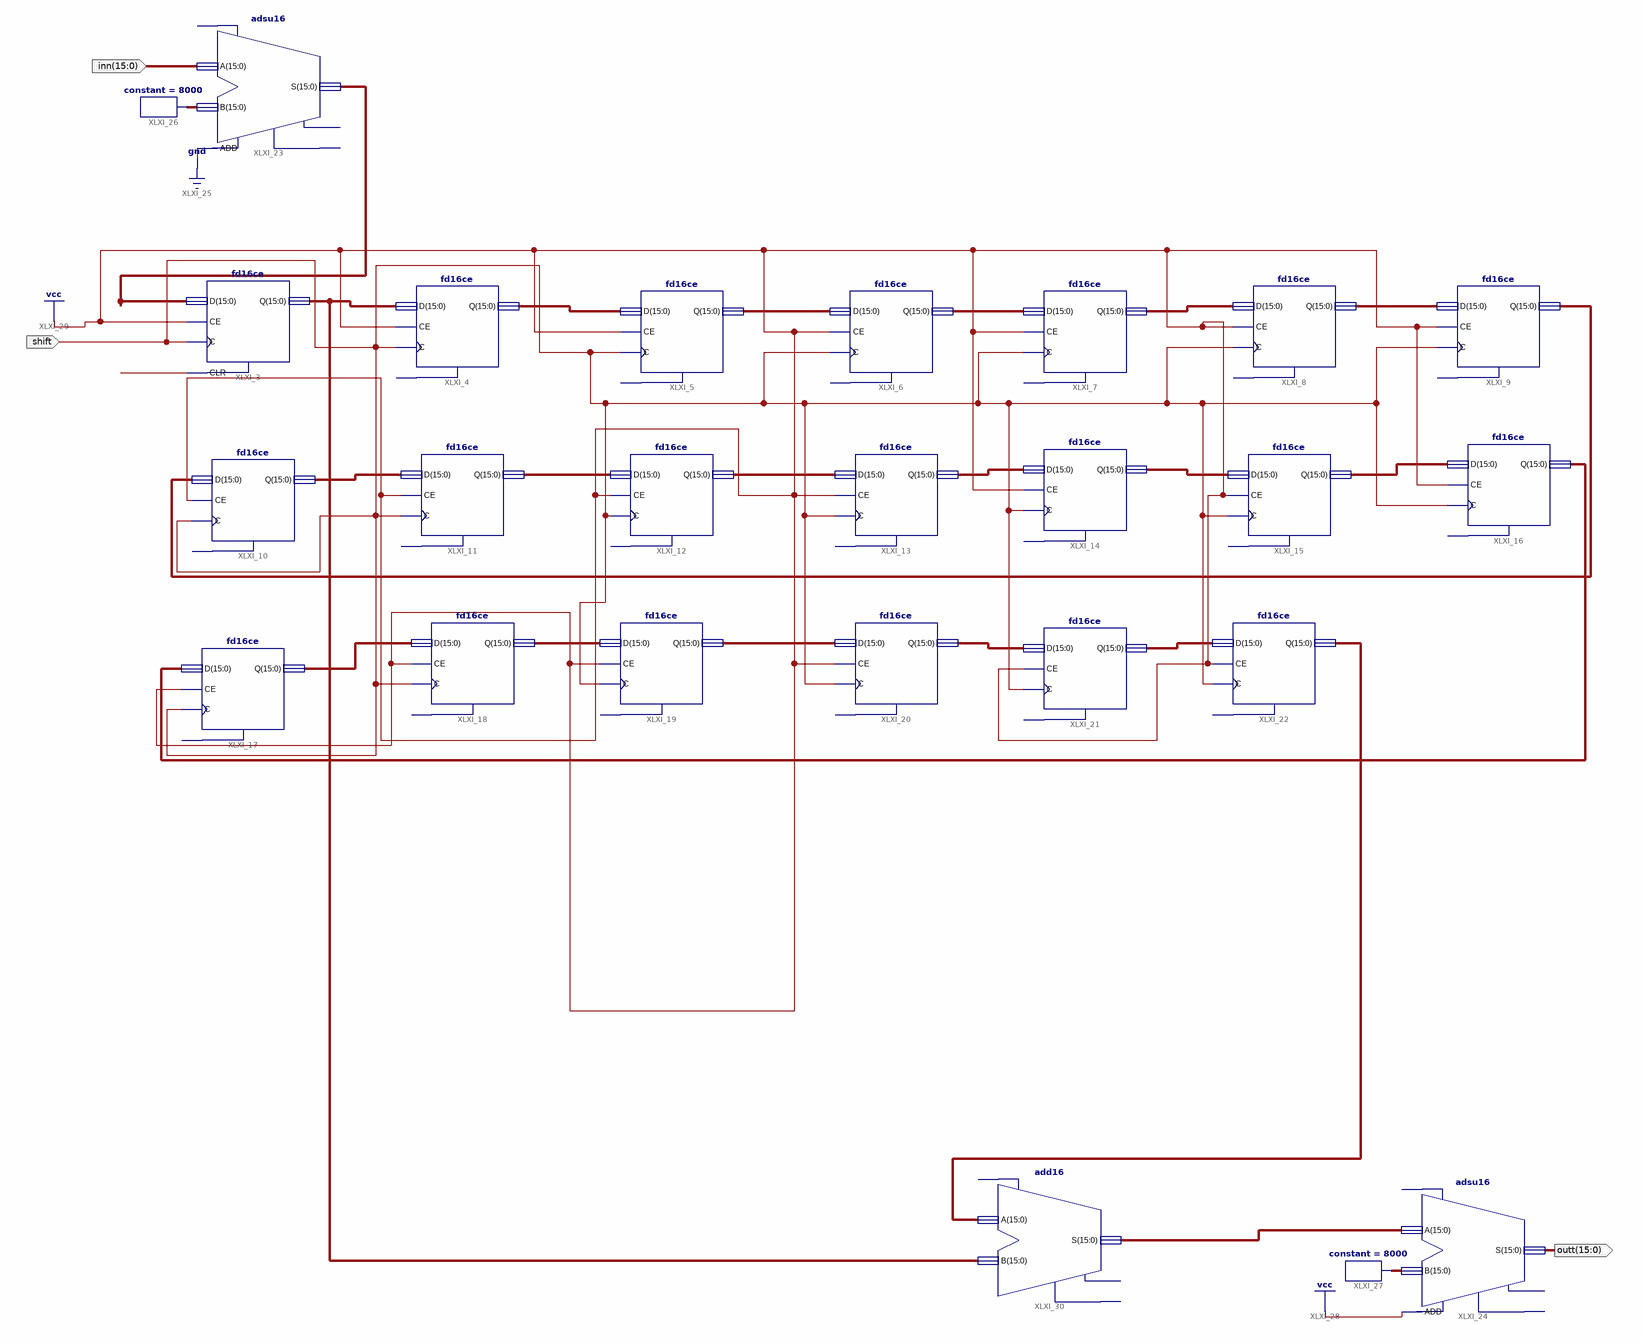
[diagram p0: schematic sheet 1]
// Xilinx ISE schematic digitalfilter.sch (artix7) as structural Verilog: 25 symbols, 3 ports
module digitalfilter (
  input  shift,
  input  [15:0] inn,
  output [15:0] outt
);

  wire XLXN_38;
  wire [15:0] XLXN_1, XLXN_2, XLXN_3, XLXN_4, XLXN_6, XLXN_7, XLXN_8, XLXN_9, XLXN_11, XLXN_12, XLXN_13,
       XLXN_14, XLXN_15, XLXN_16, XLXN_17, XLXN_18, XLXN_19, XLXN_20, XLXN_21, XLXN_22, XLXN_40, XLXN_44,
       XLXN_61, XLXN_62;

  fd16ce XLXI_3 (.C(shift), .CE(1'b1), .CLR(XLXN_38), .D(XLXN_1), .Q(XLXN_2));
  fd16ce XLXI_4 (.C(shift), .CE(1'b1), .D(XLXN_2), .Q(XLXN_3));  // open: CLR
  fd16ce XLXI_5 (.C(shift), .CE(1'b1), .D(XLXN_3), .Q(XLXN_4));  // open: CLR
  fd16ce XLXI_6 (.C(shift), .CE(1'b1), .D(XLXN_4), .Q(XLXN_11));  // open: CLR
  fd16ce XLXI_7 (.C(shift), .CE(1'b1), .D(XLXN_11), .Q(XLXN_12));  // open: CLR
  fd16ce XLXI_8 (.C(shift), .CE(1'b1), .D(XLXN_12), .Q(XLXN_19));  // open: CLR
  fd16ce XLXI_9 (.C(shift), .CE(1'b1), .D(XLXN_19), .Q(XLXN_21));  // open: CLR
  fd16ce XLXI_10 (.C(shift), .CE(1'b1), .D(XLXN_21), .Q(XLXN_6));  // open: CLR
  fd16ce XLXI_11 (.C(shift), .CE(1'b1), .D(XLXN_6), .Q(XLXN_7));  // open: CLR
  fd16ce XLXI_12 (.C(shift), .CE(1'b1), .D(XLXN_7), .Q(XLXN_8));  // open: CLR
  fd16ce XLXI_13 (.C(shift), .CE(1'b1), .D(XLXN_8), .Q(XLXN_9));  // open: CLR
  fd16ce XLXI_14 (.C(shift), .CE(1'b1), .D(XLXN_9), .Q(XLXN_13));  // open: CLR
  fd16ce XLXI_15 (.C(shift), .CE(1'b1), .D(XLXN_13), .Q(XLXN_20));  // open: CLR
  fd16ce XLXI_16 (.C(shift), .CE(1'b1), .D(XLXN_20), .Q(XLXN_22));  // open: CLR
  fd16ce XLXI_17 (.C(shift), .CE(1'b1), .D(XLXN_22), .Q(XLXN_14));  // open: CLR
  fd16ce XLXI_18 (.C(shift), .CE(1'b1), .D(XLXN_14), .Q(XLXN_15));  // open: CLR
  fd16ce XLXI_19 (.C(shift), .CE(1'b1), .D(XLXN_15), .Q(XLXN_16));  // open: CLR
  fd16ce XLXI_20 (.C(shift), .CE(1'b1), .D(XLXN_16), .Q(XLXN_17));  // open: CLR
  fd16ce XLXI_21 (.C(shift), .CE(1'b1), .D(XLXN_17), .Q(XLXN_18));  // open: CLR
  fd16ce XLXI_22 (.C(shift), .CE(1'b1), .D(XLXN_18), .Q(XLXN_61));  // open: CLR
  adsu16 XLXI_23 (.A(inn), .ADD(1'b0), .B(XLXN_40), .S(XLXN_1));  // open: CI, CO, OFL
  adsu16 XLXI_24 (.A(XLXN_62), .ADD(1'b1), .B(XLXN_44), .S(outt));  // open: CI, CO, OFL
  constant #(.CValue("8000")) XLXI_26 (.O(XLXN_40));
  constant #(.CValue("8000")) XLXI_27 (.O(XLXN_44));
  add16 XLXI_30 (.A(XLXN_61), .B(XLXN_2), .S(XLXN_62));  // open: CI, CO, OFL
endmodule
